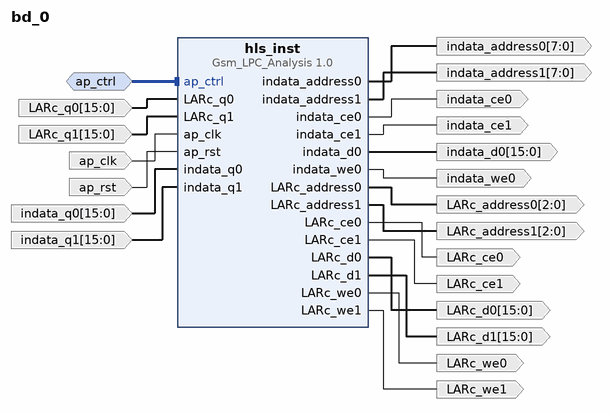
[diagram p0: block diagram of the top level]
# Vivado block design bd_0, xcu50-fsvh2104-2-e, Vivado 2023.2
create_bd_design bd_0

create_bd_intf_port -mode Slave -vlnv xilinx.com:interface:acc_handshake_rtl:1.0 ap_ctrl
create_bd_port -dir O -from 2 -to 0 -type data LARc_address0
create_bd_port -dir O -from 2 -to 0 -type data LARc_address1
create_bd_port -dir O LARc_ce0
create_bd_port -dir O LARc_ce1
create_bd_port -dir O -from 15 -to 0 -type data LARc_d0
create_bd_port -dir O -from 15 -to 0 -type data LARc_d1
create_bd_port -dir I -from 15 -to 0 -type data LARc_q0
create_bd_port -dir I -from 15 -to 0 -type data LARc_q1
create_bd_port -dir O LARc_we0
create_bd_port -dir O LARc_we1
create_bd_port -dir I -type clk ap_clk
set_property -dict {CONFIG.FREQ_HZ 125000000.0} [get_bd_ports ap_clk]
create_bd_port -dir I -type rst ap_rst
set_property -dict {CONFIG.POLARITY ACTIVE_HIGH} [get_bd_ports ap_rst]
create_bd_port -dir O -from 7 -to 0 -type data indata_address0
create_bd_port -dir O -from 7 -to 0 -type data indata_address1
create_bd_port -dir O indata_ce0
create_bd_port -dir O indata_ce1
create_bd_port -dir O -from 15 -to 0 -type data indata_d0
create_bd_port -dir I -from 15 -to 0 -type data indata_q0
create_bd_port -dir I -from 15 -to 0 -type data indata_q1
create_bd_port -dir O indata_we0

create_bd_cell -type ip -vlnv xilinx.com:hls:Gsm_LPC_Analysis:1.0 hls_inst

# ---- connections ----

connect_bd_intf_net -intf_net ap_ctrl_0_1 [get_bd_intf_ports ap_ctrl] [get_bd_intf_pins hls_inst/ap_ctrl]
connect_bd_net -net LARc_q0_0_1 [get_bd_ports LARc_q0] [get_bd_pins hls_inst/LARc_q0]
connect_bd_net -net LARc_q1_0_1 [get_bd_ports LARc_q1] [get_bd_pins hls_inst/LARc_q1]
connect_bd_net -net ap_clk_0_1 [get_bd_ports ap_clk] [get_bd_pins hls_inst/ap_clk]
connect_bd_net -net ap_rst_0_1 [get_bd_ports ap_rst] [get_bd_pins hls_inst/ap_rst]
connect_bd_net [get_bd_pins hls_inst/LARc_address0] [get_bd_ports LARc_address0]
connect_bd_net [get_bd_pins hls_inst/LARc_address1] [get_bd_ports LARc_address1]
connect_bd_net [get_bd_pins hls_inst/LARc_ce0] [get_bd_ports LARc_ce0]
connect_bd_net [get_bd_pins hls_inst/LARc_ce1] [get_bd_ports LARc_ce1]
connect_bd_net [get_bd_pins hls_inst/LARc_d0] [get_bd_ports LARc_d0]
connect_bd_net [get_bd_pins hls_inst/LARc_d1] [get_bd_ports LARc_d1]
connect_bd_net [get_bd_pins hls_inst/LARc_we0] [get_bd_ports LARc_we0]
connect_bd_net [get_bd_pins hls_inst/LARc_we1] [get_bd_ports LARc_we1]
connect_bd_net [get_bd_pins hls_inst/indata_address0] [get_bd_ports indata_address0]
connect_bd_net [get_bd_pins hls_inst/indata_address1] [get_bd_ports indata_address1]
connect_bd_net [get_bd_pins hls_inst/indata_ce0] [get_bd_ports indata_ce0]
connect_bd_net [get_bd_pins hls_inst/indata_ce1] [get_bd_ports indata_ce1]
connect_bd_net [get_bd_pins hls_inst/indata_d0] [get_bd_ports indata_d0]
connect_bd_net [get_bd_pins hls_inst/indata_we0] [get_bd_ports indata_we0]
connect_bd_net -net indata_q0_0_1 [get_bd_ports indata_q0] [get_bd_pins hls_inst/indata_q0]
connect_bd_net -net indata_q1_0_1 [get_bd_ports indata_q1] [get_bd_pins hls_inst/indata_q1]

validate_bd_design
save_bd_design
